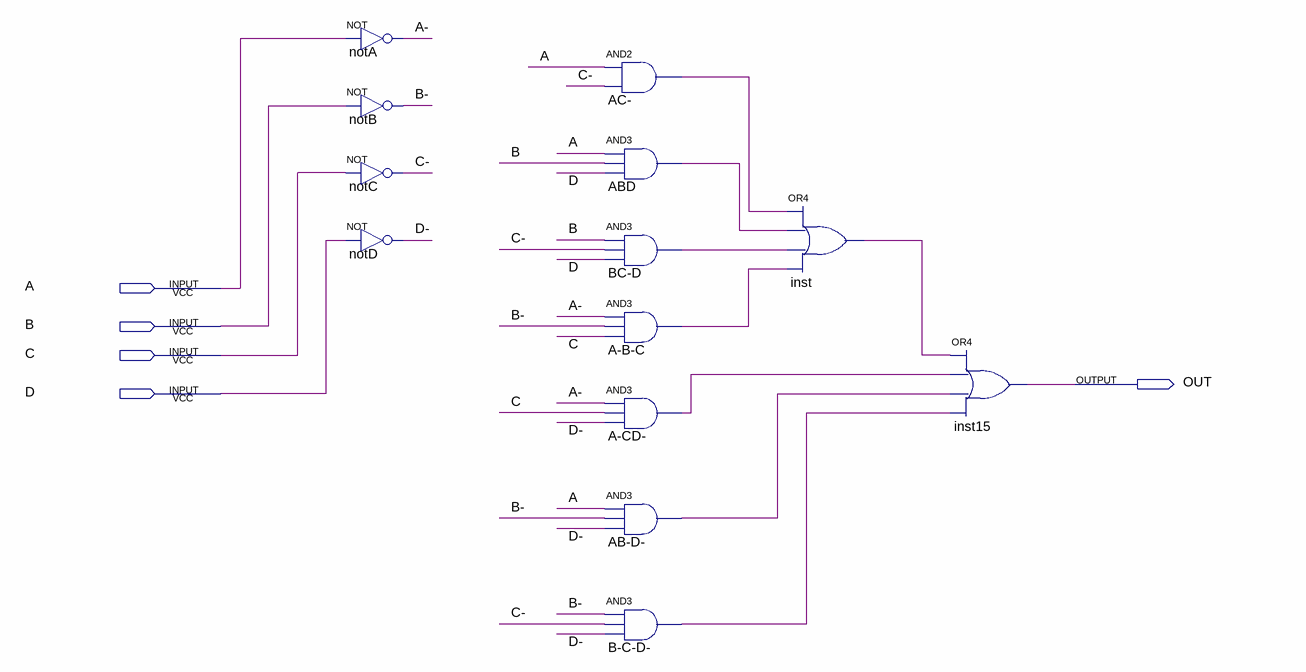
[diagram p0: schematic sheet]
// Quartus schematic d.bdf as structural Verilog: 13 symbols, 5 pins
module d (
  input  A,
  input  B,
  input  C,
  input  D,
  output OUT
);

  wire \A- , A_B_C_out, A_CD__out, AB_D__out, ABD_out, AC__out, \B- , B_C_D__out, BC_D_out, \C- , \D- ,
       inst_out;

  not notA (\A- , A);
  not notB (\B- , B);
  not notC (\C- , C);
  not notD (\D- , D);
  and \AC-  (AC__out, A, \C- );
  and ABD (ABD_out, A, B, D);
  and \BC-D  (BC_D_out, B, \C- , D);
  and \A-B-C  (A_B_C_out, \A- , \B- , C);
  and \A-CD-  (A_CD__out, \A- , C, \D- );
  and \AB-D-  (AB_D__out, A, \B- , \D- );
  and \B-C-D-  (B_C_D__out, \B- , \C- , \D- );
  or inst (inst_out, AC__out, ABD_out, BC_D_out, A_B_C_out);
  or inst15 (OUT, inst_out, A_CD__out, AB_D__out, B_C_D__out);
endmodule
